# EAGLE schematic system_driver (EAGLE 7.2.0)
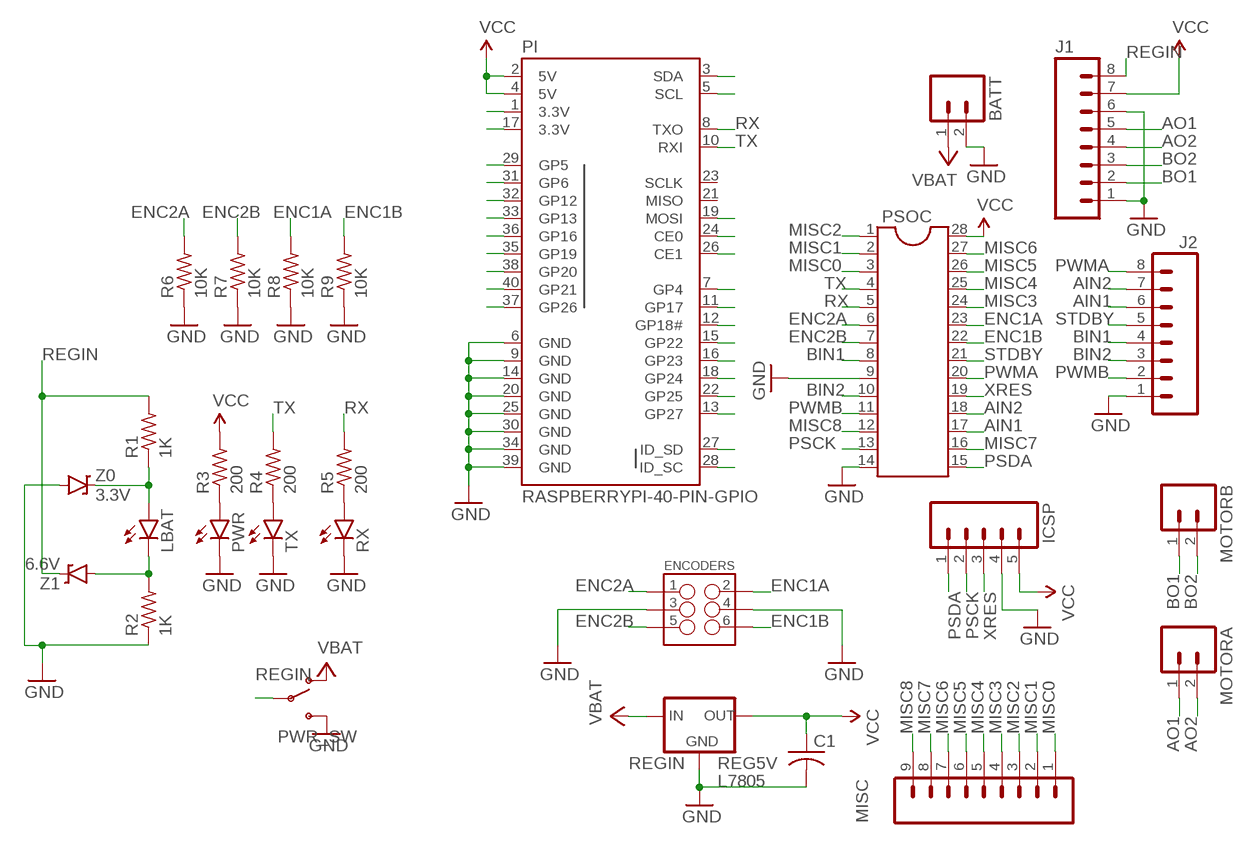
[diagram p0: schematic, sheet 1]

## Parts
BATT  M023.5MM  [SCREWTERMINAL-3.5MM-2]
C1  C-US025-024X044  [C025-024X044]
ENCODERS  M03X2FEMALE  [2X3]
ICSP  M05LOCK_LONGPADS  [1X05_LOCK_LONGPADS]
J1  M08LONGPADS  [1X08_LONGPADS]
J2  M08LONGPADS  [1X08_LONGPADS]
LBAT  LED-FKIT-1206  [FKIT-LED-1206]
MISC  M09LONGPADS  [1X09_LONGPADS]
MOTORA  M023.5MM  [SCREWTERMINAL-3.5MM-2]
MOTORB  M023.5MM  [SCREWTERMINAL-3.5MM-2]
PI  RASPBERRYPI-40-PIN-GPIO  [2X20-SHROUDED]
PSOC  DIL28-3  [DIL28-3]
PWR  LED-FKIT-1206  [FKIT-LED-1206]
PWR_SW  SWITCH-SPDTPTH  [SWITCH-SPDT]
R1  1K  R-US_M1206  [M1206]
R2  1K  R-US_M1206  [M1206]
R3  200  R-US_M1206  [M1206]
R4  200  R-US_M1206  [M1206]
R5  200  R-US_M1206  [M1206]
R6  10K  R-US_M1206  [M1206]
R7  10K  R-US_M1206  [M1206]
R8  10K  R-US_M1206  [M1206]
R9  10K  R-US_M1206  [M1206]
REG5V  L7805  V_REG_LD1117VXX  [78XXL]
RX  LED-FKIT-1206  [FKIT-LED-1206]
TX  LED-FKIT-1206  [FKIT-LED-1206]
Z0  3.3V  DIODE-ZENER16V  [SOD-123]
Z1  6.6V  DIODE-ZENER16V  [SOD-123]

## Nets
3.3V: PI.1(3.3V) PI.17(3.3V)
AIN1: J2.6 PSOC.17
AIN2: J2.7 PSOC.18
AO1: J1.5 MOTORA.1
AO2: J1.4 MOTORA.2
BIN1: J2.4 PSOC.8
BIN2: J2.3 PSOC.10
BO1: J1.2 MOTORB.1
BO2: J1.3 MOTORB.2
CE0: PI.24(CE0)
CE1: PI.26(CE1)
ENC1A: ENCODERS.2 PSOC.23 R8.2
ENC1B: ENCODERS.6 PSOC.22 R9.2
ENC2A: ENCODERS.1 PSOC.6 R6.2
ENC2B: ENCODERS.5 PSOC.7 R7.2
GND: BATT.2 C1.2 ENCODERS.3 ENCODERS.4 ICSP.4 J1.1 J1.6 J2.1 PI.6(GND) PI.9(GND) PI.14(GND) PI.20(GND) PI.25(GND) PI.30(GND) PI.34(GND) PI.39(GND) PSOC.9 PSOC.14 PWR.C PWR_SW.3(S) R2.1 R6.1 R7.1 R8.1 R9.1 REG5V.IN(GND) RX.C TX.C Z0.A
GP4: PI.7(GP4)
GP5: PI.29(GP5)
GP6: PI.31(GP6)
GP12: PI.32(GP12)
GP13: PI.33(GP13)
GP16: PI.36(GP16)
GP17: PI.11(GP17)
GP18: PI.12(GP18#)
GP19: PI.35(GP19)
GP20: PI.38(GP20)
GP21: PI.40(GP21)
GP22: PI.15(GP22)
GP23: PI.16(GP23)
GP24: PI.18(GP24)
GP25: PI.22(GP25)
GP26: PI.37(GP26)
GP27: PI.13(GP27)
ID_SC: PI.28(ID_SC)
ID_SD: PI.27(ID_SD)
MISC0: MISC.1 PSOC.3
MISC1: MISC.2 PSOC.2
MISC2: MISC.3 PSOC.1
MISC3: MISC.4 PSOC.24
MISC4: MISC.5 PSOC.25
MISC5: MISC.6 PSOC.26
MISC6: MISC.7 PSOC.27
MISC7: MISC.8 PSOC.16
MISC8: MISC.9 PSOC.12
MOSI: PI.19(MOSI)
N$1: LBAT.A R1.1 Z0.C
N$2: LBAT.C R2.2 Z1.A
N$3: PWR.A R3.1
N$4: R4.1 TX.A
N$5: R5.1 RX.A
PI_SCL: PI.5(SCL)
PI_SDA: PI.3(SDA)
PSCK: ICSP.2 PSOC.13
PSDA: ICSP.1 PSOC.15
PWMA: J2.8 PSOC.20
PWMB: J2.2 PSOC.11
REGIN: J1.8 PWR_SW.2(P) R1.2 REG5V.OUT(IN) Z1.C ; supply symbol labelled VBAT
RX: PI.8(TXO) PSOC.5 R5.2
STDBY: J2.5 PSOC.21
TX: PI.10(RXI) PSOC.4 R4.2
V+: BATT.1 PWR_SW.1(O) ; supply symbol labelled VBAT
VCC: C1.1 ICSP.5 J1.7 PI.2(5V) PI.4(5V) PSOC.28 R3.2 REG5V.GND(OUT)
XRES: ICSP.3 PSOC.19
Unconnected: PI.21(MISO) PI.23(SCLK)

## Library data of the parts
BATT MOTORA MOTORB = SparkFun-Connectors:M02: Standard 2-pin 0.1" header. Use with - straight break away headers ( PRT-00116) - right angle break away headers (PRT-00553) - swiss pins (PRT-00743) - machine pins (PRT-00117) - female headers (PRT-00115) Molex polarized connector foot print use with: PRT-08233 with associated crimp pins and housings. 2.54_SCREWTERM for use with PRT-10571. 3.5mm Screw Terminal footprints for PRT-08084 5mm Screw Terminal footprints for use with PRT-08432; PROD_ID: CONN-08399
C1 = rcl:C-US: CAPACITOR, American symbol
ENCODERS = SparkFun-Connectors:M03X2: 2x3 .1" header. Shrouded, with keying- CONN-10681 SMT- CONN-11415 Pogo pins- HW-11044; PROD_ID: CONN-11566; VALUE: FEMALE 2x3
ICSP = SparkFun-Connectors:M05: Header 5 Standard 5-pin 0.1" header. Use with straight break away headers (SKU : PRT-00116), right angle break away headers (PRT-00553), swiss pins (PRT-00743), machine pins (PRT-00117), and female headers (PRT-00115). Molex polarized connector foot print use with SKU : PRT-08230 with associated crimp pins and housings.
J1 J2 = SparkFun-Connectors:M08: Header 8 Standard 8-pin 0.1" header. Use with straight break away headers (SKU : PRT-00116), right angle break away headers (PRT-00553), swiss pins (PRT-00743), machine pins (PRT-00117), and female headers (PRT-00115).
LBAT PWR RX TX = SparkFun-LED:LED: LEDs Standard schematic elements and footprints for 5mm, 3mm, 1206, and 0603 sized LEDs. 5mm - Spark Fun Electronics SKU : COM-00529 (and others)
MISC = SparkFun-Connectors:M09: Header 9 Standard 9-pin 0.1" header. Use with straight break away headers (SKU : PRT-00116), right angle break away headers (PRT-00553), swiss pins (PRT-00743), machine pins (PRT-00117), and female headers (PRT-00115).
PI = SparkFun-Boards:RASPBERRYPI-40-PIN-GPIO: Second Generation Raspberry Pi GPIO Header 2x20 pin connector, as found on B, B+, A+ models.
PSOC = ic-package:DIL28: Dual In Line
PWR_SW = SparkFun-Electromechanical:SWITCH-SPDT: SPDT Switch Simple slide switch, Spark Fun Electronics SKU : COM-00102 DPDT SMT slide switch, AYZ0202, SWCH-08179; PROD_ID: SWCH-08261
R1-R9 = resistor:R-US_: RESISTOR, American symbol
REG5V = SparkFun-PowerIC:V_REG_LD1117VXX: LD1117VXX voltage regulator. We carry the 3.3V version (COM-00526) in TO-220 package.
Z0 Z1 = SparkFun-DiscreteSemi:DIODE-ZENER: Zener Diode Production Part - 8199 3.4V Zener Voltage; PROD_ID: DIO-12440; VALUE: 16V

## Net classes
0 default: width 0.254 mm